# EAGLE design overview_mcu (EAGLE 9.5.0)
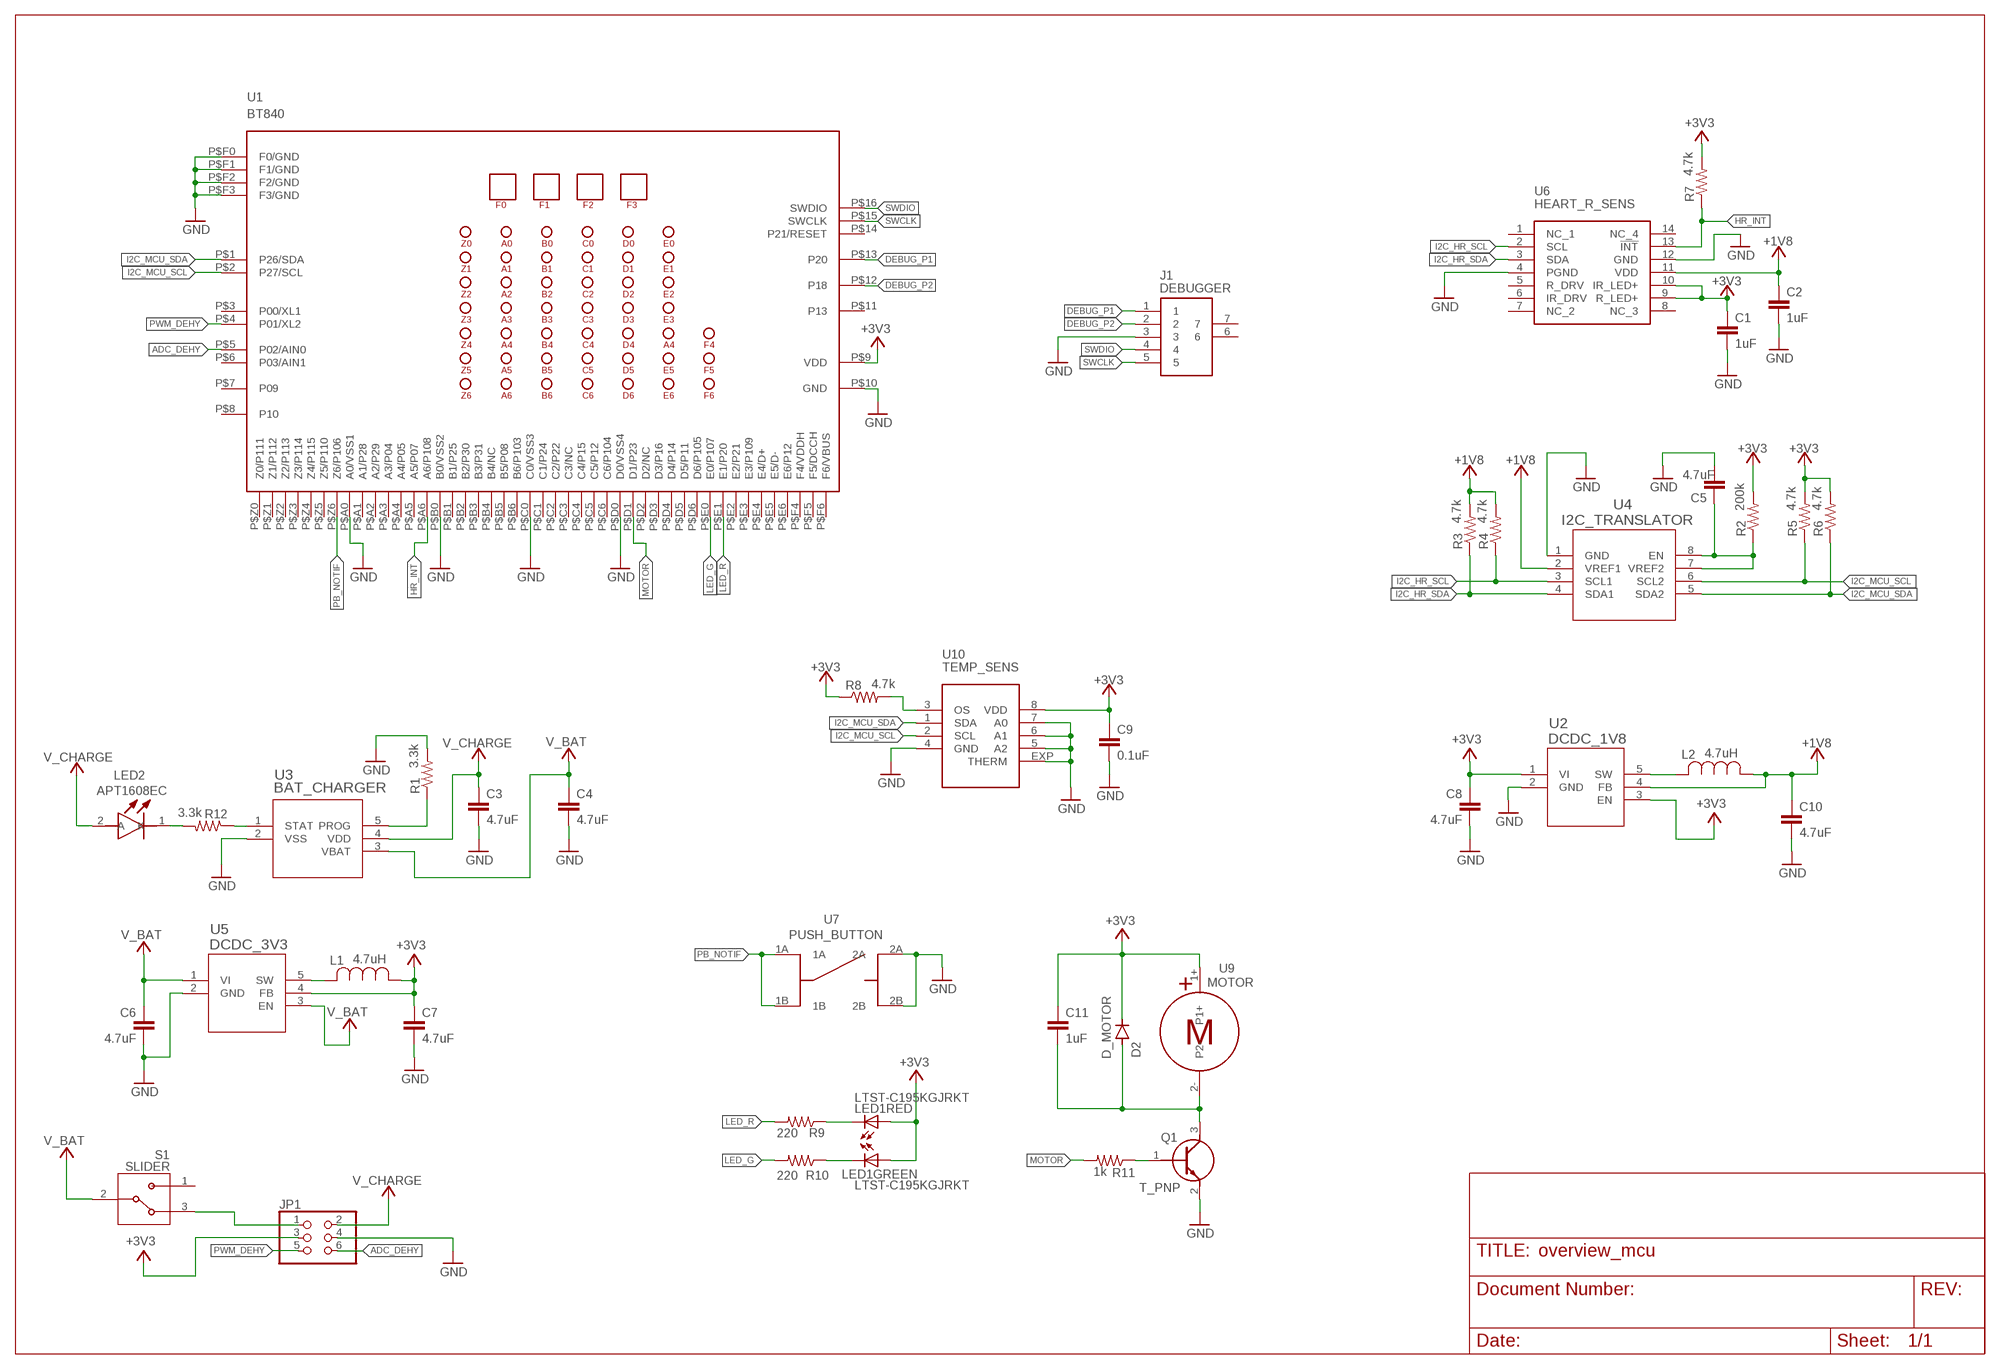
[diagram p0: schematic, sheet 1]

## Parts
C1  1uF  C-EUC0402K  [C0402K]
C2  1uF  C-EUC0402K  [C0402K]
C3  4.7uF  C-EUC0402K  [C0402K]
C4  4.7uF  C-EUC0402K  [C0402K]
C5  4.7uF  C-EUC0402K  [C0402K]
C6  4.7uF  C-EUC0402K  [C0402K]
C7  4.7uF  C-EUC0402K  [C0402K]
C8  4.7uF  C-EUC0402K  [C0402K]
C9  0.1uF  C-EUC0402K  [C0402K]
C10  4.7uF  C-EUC0402K  [C0402K]
C11  1uF  C-EUC0402K  [C0402K]
D2  D_MOTOR  CGRM4001-G  [SOD-123_MINI-SMA]
J1  DEBUGGER  [0512810594]
JP1  PINHD-2X3  [2X03]
L1  4.7uH  L_0604  [IND_1608]
L2  4.7uH  L_0604  [IND_1608]
LED1  LTST-C195KGJRKT  [LED-SMT]
LED2  APT1608EC  [LEDC1608X85N]
Q1  T_PNP  [SOT95P240X93-3N]
R1  3.3k  R-US_R0402  [R0402]
R2  200k  R-US_R0402  [R0402]
R3  4.7k  R-US_R0402  [R0402]
R4  4.7k  R-US_R0402  [R0402]
R5  4.7k  R-US_R0402  [R0402]
R6  4.7k  R-US_R0402  [R0402]
R7  4.7k  R-US_R0402  [R0402]
R8  4.7k  R-US_R0402  [R0402]
R9  220  R-US_R0402  [R0402]
R10  220  R-US_R0402  [R0402]
R11  1k  R-US_R0402  [R0402]
R12  3.3k  R-US_R0402  [R0402]
S1  SLIDER  [SW_CJS-1200TA]
U1  BT840  [BT840]
U2  DCDC_1V8  [DBV5]
U3  BAT_CHARGER  [SOT-23-5_MC]
U4  I2C_TRANSLATOR  [DQE8]
U5  DCDC_3V3  [DBV5]
U6  HEART_R_SENS  [MAX30102]
U7  PUSH_BUTTON  [PUSH_BUTTON]
U9  MOTOR  [MOTOR]
U10  TEMP_SENS  [MAX30205]

## Nets
+1V8: C2.1 C10.1 L2.1 R3.2 R4.2 U2.4(FB) U4.2(VREF1) U6.11(VDD)
+3V3: C1.1 C7.1 C8.1 C9.1 C11.1 D2.C JP1.3 L1.1 LED1.P$1(GREEN:A) LED1.P$2(RED:A) R2.2 R5.2 R6.2 R7.2 R8.1 U1.P$9(VDD) U2.1(VI) U2.3(EN) U5.4(FB) U6.9(R_LED+) U6.10(IR_LED+) U9.1+ U10.8(VDD)
ADC_DEHY: JP1.6 U1.P$5(P02/AIN0)
DEBUG_P1: J1.1 U1.P$13(P20)
DEBUG_P2: J1.2 U1.P$12(P18)
GND: C1.2 C2.2 C3.2 C4.2 C5.2 C6.2 C7.2 C8.2 C9.2 C10.2 J1.3 JP1.4 Q1.2(E) R1.2 U1.P$10(GND) U1.P$A0(A0/VSS1) U1.P$B0(B0/VSS2) U1.P$C0(C0/VSS3) U1.P$D0(D0/VSS4) U1.P$F0(F0/GND) U1.P$F1(F1/GND) U1.P$F2(F2/GND) U1.P$F3(F3/GND) U2.2(GND) U3.2(VSS) U4.1(GND) U5.2(GND) U6.4(PGND) U6.12(GND) U7.2A U7.2B U10.4(GND) U10.5(A2) U10.6(A1) U10.7(A0) U10.EXP(THERM)
HR_INT: R7.1 U1.P$A6(A6/P108) U6.13(!INT)
I2C_HR_SCL: R4.1 U4.3(SCL1) U6.2(SCL)
I2C_HR_SDA: R3.1 U4.4(SDA1) U6.3(SDA)
I2C_MCU_SCL: R5.1 U1.P$2(P27/SCL) U4.6(SCL2) U10.2(SCL)
I2C_MCU_SDA: R6.1 U1.P$1(P26/SDA) U4.5(SDA2) U10.1(SDA)
LED_G: R10.2 U1.P$E0(E0/P107)
LED_R: R9.2 U1.P$E1(E1/P20)
MOTOR: R11.2 U1.P$D1(D1/P23)
N$1: JP1.1 S1.3
N$2: R1.1 U3.5(PROG)
N$3: C5.1 R2.1 U4.7(VREF2) U4.8(EN)
N$4: L1.2 U5.5(SW)
N$5: L2.2 U2.5(SW)
N$6: LED1.P$4(RED:C) R9.1
N$7: R8.2 U10.3(OS)
N$8: LED1.P$3(GREEN:C) R10.1
N$9: R12.1 U3.1(STAT)
N$10: LED2.1(K) R12.2
N$11: C11.2 D2.A Q1.3(C) U9.2-
N$12: Q1.1(B) R11.1
PB_NOTIF: U1.P$Z6(Z6/P106) U7.1A U7.1B
PWM_DEHY: JP1.5 U1.P$4(P01/XL2)
SWCLK: J1.5 U1.P$15(SWCLK)
SWDIO: J1.4 U1.P$16(SWDIO)
V_BAT: C4.1 C6.1 S1.2 U3.3(VBAT) U5.1(VI) U5.3(EN)
V_CHARGE: C3.1 JP1.2 LED2.2(A) U3.4(VDD)
Unconnected: J1.6 J1.7 S1.1 U1.P$3(P00/XL1) U1.P$6(P03/AIN1) U1.P$7(P09) U1.P$8(P10) U1.P$11(P13) U1.P$14(P21/RESET) U1.P$A1(A1/P28) U1.P$A2(A2/P29) U1.P$A3(A3/P04) U1.P$A4(A4/P05) U1.P$A5(A5/P07) U1.P$B1(B1/P25) U1.P$B2(B2/P30) U1.P$B3(B3/P31) U1.P$B4(B4/NC) U1.P$B5(B5/P08) U1.P$B6(B6/P103) U1.P$C1(C1/P24) U1.P$C2(C2/P22) U1.P$C3(C3/NC) U1.P$C4(C4/P15) U1.P$C5(C5/P12) U1.P$C6(C6/P104) U1.P$D2(D2/NC) U1.P$D3(D3/P16) U1.P$D4(D4/P14) U1.P$D5(D5/P11) U1.P$D6(D6/P105) U1.P$E2(E2/P21) U1.P$E3(E3/P109) U1.P$E4(E4/D+) U1.P$E5(E5/D-) U1.P$E6(E6/P12) U1.P$F4(F4/VDDH) U1.P$F5(F5/DCCH) U1.P$F6(F6/VBUS) U1.P$Z0(Z0/P111) U1.P$Z1(Z1/P112) U1.P$Z2(Z2/P113) U1.P$Z3(Z3/P114) U1.P$Z4(Z4/P115) U1.P$Z5(Z5/P110) U6.1(NC_1) U6.5(R_DRV) U6.6(IR_DRV) U6.7(NC_2) U6.8(NC_3) U6.14(NC_4)

## Library data of the parts
C1-C11 = resistor:C-EU: CAPACITOR, European symbol
D2 = diode:CGRM400*-G: Molded plasitc,JEDEC SOD-123/Mini SMA Source: Comchip CGRM4001-G.pdf
J1 = FPC_0512810594:DEBUGGER: CONN FFC FPC 5POS 0.50MM R/A Source: Datasheet <http://www.molex.com/webdocs/datasheets/pdf/en-us//0512810594_FFC_FPC_CONNECTORS.pdf>; DESCRIPTION: CONN FFC FPC 5POS 0.50MM R/A; LINK: https://www.digikey.com/product-detail/en/molex-llc/0512810594/WM12846CT-ND/4176653; MANUFACTURER_NAME: Molex; MANUFACTURER_PART_NUM: 0512810594
JP1 = pinhead:PINHD-2X3: PIN HEADER
L1 L2 = L_0604:L_0604; MANUFACTURER_PART_NUMBER: GLFR1608T4R7MLR; VENDOR: TDK
LED1 = Led_LTST-C195KGJRKT:LTST-C195KGJRKT; DESCRIPTION: LED GREEN/RED CLEAR CHIP SMD; LINK: https://www.digikey.com/product-detail/en/lite-on-inc/LTST-C195KGJRKT/160-1452-1-ND/386846; MANUFACTURER: Lite-On Inc.; MANUFACTURER_PART_NUM: LTST-C195KGJRKT
LED2 = LED_APT1608EC:APT1608EC: Standard LEDs - SMD HI EFF RED WTR CLR Source: Datasheet <http://docs-emea.rs-online.com/webdocs/142e/0900766b8142ead4.pdf>; DESCRIPTION: LED RED CLEAR CHIP SMD; LINK: https://www.digikey.com/product-detail/en/kingbright/APT1608EC/754-1117-1-ND/1747834; MANUFACTURER: Kingbright; MANUFACTURER_PART_NUM: APT1608EC
Q1 = transistor:T_PNP: Transistor GP BJT NPN 40V 0.2A SOT23 Fairchild MMBT3904 NPN Bipolar Transistor, 0.2 A, 40 V, 3-Pin SOT-23 Source: Datasheet <https://www.fairchildsemi.com/datasheets/MM/MMBT3904.pdf>; DESCRIPTION: TRANS NPN 40V 0.2A SOT23; LINK: https://www.digikey.com/products/en?keywords=MMBT3904TPMSCT; MANUFACTURER: Micro Commercial Co; MANUFACTURER_PART_NUM: MMBT3904-TP
R1-R12 = resistor:R-US_: RESISTOR, American symbol
S1 = slider:SLIDER: Switch Slide N.O./N.C. SPDT Raised Slide 0.1A 24VDC J-Hook SMD Embossed T/R; DESCRIPTION: SWITCH SLIDE SPDT 100MA 6V; LINK: https://www.digikey.com/product-detail/en/nidec-copal-electronics/CJS-1200TA/563-1021-1-ND/948401; MANUFACTURER: Nidec Copal Electronics; MANUFACTURER_PART: CJS-1200TA
U1 = Nrf52_BT840:BT840; DESCRIPTION: NRF52840 BLUETOOTH 5, THREAD, ZI; LINK: https://www.fanstel.com/bt840f-nrf52840-ble-5-module-secure-iot-802154-thread-zigbee; MANUFACTURER: Fanstel; MANUFACTURER_PART_NUM: BT840
U2 = DCDC_1V8_TPS62202DBVR:DCDC_1V8; DESCRIPTION: IC REG BUCK 1.8V 0.3A SYNC SOT23; LINK: https://www.digikey.com/product-detail/en/texas-instruments/TPS62202DBVR/296-16730-1-ND/616311; MANUFACTURER: Texas Instruments; MANUFACTURER_PART_NUM: TPS62202DBVR
U3 = BatManager_MCP73831:BAT_CHARGER; DESCRIPTION: IC CONTROLLR LI-ION 4.2V SOT23-5; LINK: https://www.digikey.com/product-detail/en/microchip-technology/MCP73831T-2ACI-OT/MCP73831T-2ACI-OTCT-ND/1979802; MANUFACTURER: Microchip; MANUFACTURER_PART_NUM: MCP73831T2ACIOT
U4 = I2Ctranslator_PCA9306DQER:I2C_TRANSLATOR; DESCRIPTION: IC TRNSLTR BIDIRECTIONAL 8X2SON; LINK: https://www.digikey.com/product-detail/en/texas-instruments/PCA9306DQER/296-27957-1-ND/2446266; MANUFACTURER: Texas Instruments; MANUFACTURER_PART_NUM: PCA9306DQER
U5 = DCDC_3V3_TPS62203DBVR:DCDC_3V3; DESCRIPTION: IC REG BUCK 3.3V 0.3A SYNC SOT23; LINK: https://www.digikey.com/product-detail/en/texas-instruments/TPS62203DBVR/296-39452-1-ND/5143400; MANUFACTURER: Texas Instruments; MANUFACTURER_PART_NUM: TPS62203DBVR
U6 = heartRate_max30102:HEART_R_SENS; DESCRIPTION: IC SENSOR OXIMETER/HEARTRATE; LINK: https://www.digikey.com/product-detail/en/maxim-integrated/MAX30102EFD/MAX30102EFD-ND/6166869; MANUFACTURER: Maxim Integrated; MANUFACTURER_PART_NUM: MAX30102EFD+
U7 = push_button:PUSH_BUTTON; DESCRIPTION: SWITCH TACTILE SPST-NO 0.05A 12V; LINK: https://www.digikey.com/product-detail/en/panasonic-electronic-components/EVQ-P7A01P/P16763CT-ND/4429456; MANUFACTURER: Panasonic Electronic Components; MANUFACTURER_PART_NUM: EVQ-P7A01P
U9 = motor:MOTOR; DESCRIPTION: VIBRATION MOTOR CYL 2.7V SMD; LINK: https://www.digikey.com/product-detail/en/jinlong-machinery-electronics-inc/Z4FC1B1301781/1670-1011-1-ND/6009936; MANUFACTURER: Jinlong Machinery & Electronics, Inc.; MANUFACTURER_PART_NUM: Z4FC1B1301781
U10 = temp_max30205:TEMP_SENS; DESCRIPTION: SWITCH TACTILE SPST-NO 0.05A 12V; LINK: https://www.digikey.com/product-detail/en/panasonic-electronic-components/EVQ-P7A01P/P16763TR-ND/4429447; MANUFACTURER: Maxim Integrated; MANUFACTURER_PART_NUM: MAX30205MTA+

## Board
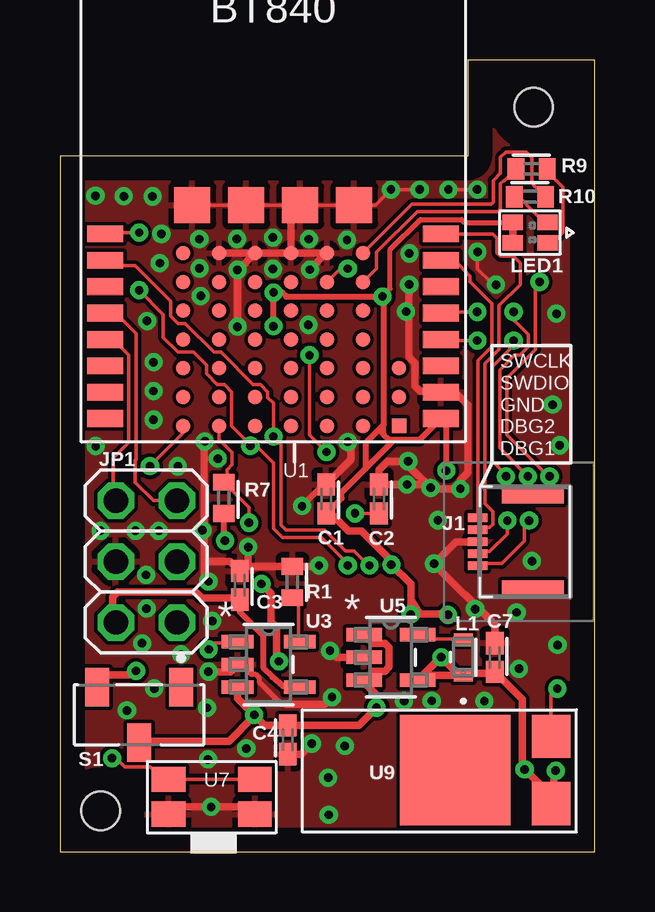
[diagram p1: board, top side]
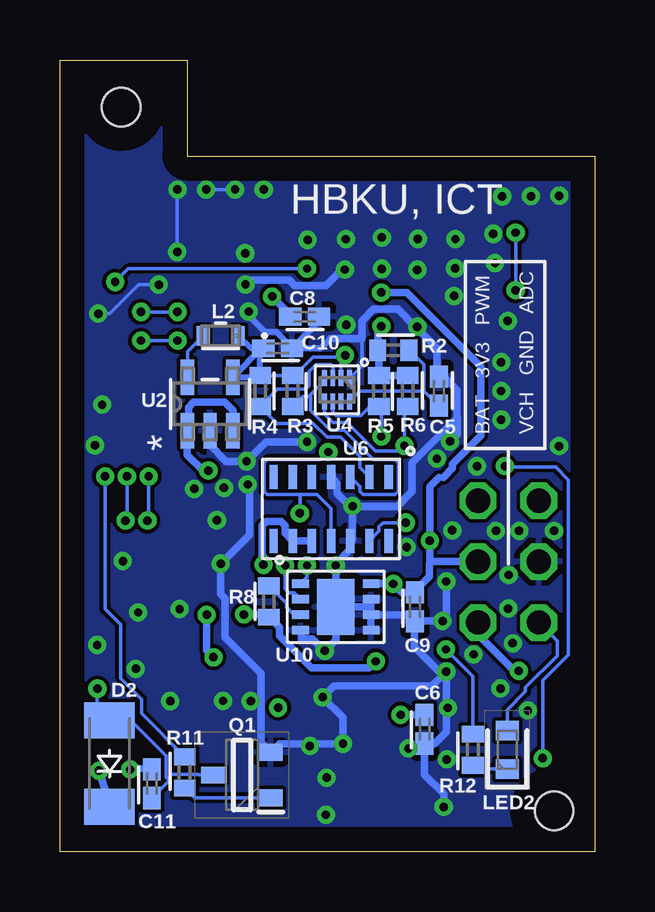
[diagram p2: board, bottom side, seen from below]

Size 22.3 x 33 mm. Coordinates in mm from the lower left corner, seen from the top.
Outline: 0,0 22.3,0 22.3,33 17,33 17,29 0,29 0,0
Copper layers (1*16): Top 0.035mm / dielectric 1.5mm / Bottom 0.035mm
Design rules "default *": minimum track width 6mil, minimum drill 0.35mm, track to track 6mil, track to pad 6mil, pad to pad 6mil, via to via 6mil, smd to smd 6mil, copper to edge 40mil, drill to drill 6mil, minimum pad ring 10mil, minimum via ring 8mil, stop-mask expansion 4mil, vias tented up to drill 0.36mm, thermal gap 10mil
Holes 1.6 mm at 19.75,31.03 1.7,1.7

### Footprints (pad centres in the part's own frame; a part is rotated, then mirrored left to right if it is on the bottom)
C0402K = smd 0.925 x 0.74: 1 -0.6,0; 2 0.6,0
SOD-123_MINI-SMA = smd 1.5 x 2.1: A 1.8,0; C -1.8,0
0512810594 = smd 0.35 x 0.8: 1 -1,1.725; 2 -0.5,1.725; 3 0,1.725; 4 0.5,1.725; 5 1,1.725 | smd 0.6 x 2.6: 6 -1.9,-0.575; 7 1.9,-0.575
2X03 = drill 1.016 octagon: 1 -2.54,-1.27; 2 -2.54,1.27; 3 0,-1.27; 4 0,1.27; 5 2.54,-1.27; 6 2.54,1.27
IND_1608 = smd 0.503 x 0.8: 1 -0.752,0; 2 0.752,0
LED-SMT = smd 0.65 x 0.85: P$1 0.425,0.725; P$2 -0.425,0.725; P$3 0.425,-0.725; P$4 -0.425,-0.725
LEDC1608X85N = smd 0.8 x 0.95: 1 -0.8,0; 2 0.8,0
SOT95P240X93-3N = smd 1 x 0.7: 1 -1.2,0.95; 2 -1.2,-0.95; 3 1.2,0
R0402 = smd 0.7 x 0.9: 1 -0.65,0; 2 0.65,0
SW_CJS-1200TA = smd 1 x 1.6: 1 -1.75,-1.15; 2 0,1.15; 3 1.75,-1.15
BT840 = smd 1.5 x 0.7: P$1 -7.112,3.847; P$2 -7.112,2.747; P$3 -7.112,1.647; P$4 -7.112,0.547; P$5 -7.112,-0.553; P$6 -7.112,-1.653; P$7 -7.112,-2.753; P$8 -7.112,-3.853; P$9 6.888,-3.853; P$10 6.888,-2.753; P$11 6.888,-1.653; P$12 6.888,-0.553; P$13 6.888,0.547; P$14 6.888,1.647; P$15 6.888,2.747; P$16 6.888,3.847 | smd 0.6 x 0.6: P$A0 -2.362,3.047; P$A1 -2.362,1.847; P$A2 -2.362,0.647; P$A3 -2.362,-0.553; P$A4 -2.362,-1.753; P$A5 -2.362,-2.953; P$A6 -2.362,-4.153; P$B0 -0.862,3.047; P$B1 -0.862,1.847; P$B2 -0.862,0.647; P$B3 -0.862,-0.553; P$B4 -0.862,-1.753; P$B5 -0.862,-2.953; P$B6 -0.862,-4.153; P$C0 0.638,3.047; P$C1 0.638,1.847; P$C2 0.638,0.647; P$C3 0.638,-0.553; P$C4 0.638,-1.753; P$C5 0.638,-2.953; P$C6 0.638,-4.153; P$D0 2.138,3.047; P$D1 2.138,1.847; P$D2 2.138,0.647; P$D3 2.138,-0.553; P$D4 2.138,-1.753; P$D5 2.138,-2.953; P$D6 2.138,-4.153; P$E0 3.638,3.047; P$E1 3.638,1.847; P$E2 3.638,0.647; P$E3 3.638,-0.553; P$E4 3.638,-1.753; P$E5 3.638,-2.953; P$E6 3.638,-4.153; P$F4 5.138,-1.753; P$F5 5.138,-2.953; P$F6 5.138,-4.153; P$Z0 -3.862,3.047; P$Z1 -3.862,1.847; P$Z2 -3.862,0.647; P$Z3 -3.862,-0.553; P$Z4 -3.862,-1.753; P$Z5 -3.862,-2.953; P$Z6 -3.862,-4.153 | smd 1.5 x 1.5: P$F0 -3.482,5.047; P$F1 -1.232,5.047; P$F2 1.018,5.047; P$F3 3.268,5.047
DBV5 = smd 1.473 x 0.559: 1 -1.118,0.95; 2 -1.118,0; 3 -1.118,-0.95; 4 1.118,-0.95; 5 1.118,0.95
SOT-23-5_MC = smd 1.321 x 0.559: 1 -1.295,0.95; 2 -1.295,0; 3 -1.295,-0.95; 4 1.295,-0.95; 5 1.295,0.95
DQE8 = smd 0.66 x 0.203: 1 -0.495,0.525; 2 -0.495,0.175; 3 -0.495,-0.175; 4 -0.495,-0.525; 5 0.495,-0.525; 6 0.495,-0.175; 7 0.495,0.175; 8 0.495,0.525
MAX30102 = smd 1 x 0.35: 1 -1.325,2.4; 2 -1.325,1.6; 3 -1.325,0.8; 4 -1.325,0; 5 -1.325,-0.8; 6 -1.325,-1.6; 7 -1.325,-2.4; 8 1.325,-2.4; 9 1.325,-1.6; 10 1.325,-0.8; 11 1.325,0; 12 1.325,0.8; 13 1.325,1.6; 14 1.325,2.4
PUSH_BUTTON = smd 1.4 x 1.05: 1A -1.859,0.721; 1B 1.741,0.721; 2A -1.859,-0.729; 2B 1.741,-0.729
MOTOR = smd 1.8 x 1.6: 1+ -1.402,-3.996; 2- 1.4,-3.996 | smd 4.6 x 4.6: 3 0,0
MAX30205 = smd 0.7 x 0.35: 1 -1.475,0.975; 2 -1.475,0.325; 3 -1.475,-0.325; 4 -1.475,-0.975; 5 1.475,-0.975; 6 1.475,-0.325; 7 1.475,0.325; 8 1.475,0.975 | smd 1.58 x 2.35: EXP 0,0

### Placement (x,y rotation side)
C1  11.1,14.7 90 top
C2  13.3,14.7 90 top
C3  7.5,11.1 90 top
C4  9.5,4.66 270 top
C5  6.5,19.2 90 bottom
C6  7.1,5.1 270 bottom
C7  18.13,8.09 90 top
C8  12.1,22.3 0 bottom
C9  7.5,10.2 270 bottom
C10  13.22,20.98 0 bottom
C11  18.47,2.83 270 bottom
D2  20.23,3.66 90 bottom
J1  19.14,12.91 90 top
JP1  3.6,12.09 90 top
L1  16.82,8.1 90 top
L2  15.6,21.5 180 bottom
LED1  19.6,25.8 90 top
LED2  3.65,4.24 90 bottom
Q1  14.71,3.19 180 bottom
R1  9.69,11.23 90 top
R2  8.4,20.9 180 bottom
R3  12.6,19.2 90 bottom
R4  13.95,19.2 90 bottom
R5  9,19.2 90 bottom
R6  7.8,19.2 90 bottom
R7  6.83,14.75 270 top
R8  13.59,10.42 90 bottom
R9  19.66,28.46 180 top
R10  19.6,27.3 0 top
R11  17.1,3.3 90 bottom
R12  5.08,4.25 270 bottom
S1  3.3,5.7 180 top
U1  9,21.9 0 top
U2  16.04,18.66 90 bottom
U3  8.7,7.8 0 top
U4  10.75,19.25 270 bottom
U5  13.8,8.1 0 top
U6  10.99,14.28 270 bottom
U7  6.39,2.29 0 top
U9  16.48,3.4 90 top
U10  10.8,10.2 0 bottom

### Tracks (layer width: path | path; a pad name or v marks a point on that pad's centre or on a via)
+1V8  (via drill 0.35)
  Top 0.152: v10.41,20.69 10.41,17.36 v11.11,16.66 | C2.1 v12.3,14.1
  Bottom 0.152: 14.02,19.78 R4.2 R3.2 12.52,19.85 11.74,20.62 10.48,20.62 | v11.11,16.66 11.43,16.34 13.66,16.34 13.8,16.2 13.8,15.01 13.66,14.88 12.3,14.88 | 12.3,14.88 11.58,14.88 10.99,14.29 U6.11 | v12.3,14.1 12.3,14.88 | 10.48,20.62 v10.41,20.69 | 13.95,20.85 C10.1 13.89,20.98 | 10.48,20.62 10.57,20.52 U4.2
  Bottom 0.254: 14.02,19.78 U2.4 13.89,20.98 | C10.1 14.33,20.98 L2.1 | R4.2 13.95,20.85
+3V3  (via drill 0.35)
  Top 0.152: 20.46,2.34 20.46,2.01 U9.1+ | 16.84,7.42 L1.1 | C7.1 17.86,7.49 17.93,7.42 | 16.72,7.35 L1.1 | 14.97,7.19 U5.4 15.12,7.35 | 16.65,7.35 L1.1 | v8.4,11.16
  Top 0.2: v13.45,23.14 13.77,23.46 13.77,25.09 15.03,26.35 16.74,26.35 16.87,26.23 LED1.P$1
  Top 0.254: R7.2 6.83,13.01 v6.88,12.96 | 13.5,23.1 v13.46,23.14 v13.45,23.14 | v8.9,21.9 v8.9,23.3 9.26,23.3 9.44,23.13 13.5,23.13 13.5,23.1 | v16.11,15.88 16.11,17.82 U1.P$9 15,17.16 13.93,17.16 | 11.13,14.1 C1.1 | 11.13,14.1 11.75,14.72 11.75,14.98 12.74,15.97 | 11.3,14.1 11.13,14.1 | 13.49,17.79 13.32,17.61 | 13.32,17.61 12.74,17.03 12.74,15.97 | 13.5,23.1 13.5,17.79 13.49,17.79 | 13.93,17.16 13.84,17.06 | 13.84,17.06 12.74,15.97 | 13.84,17.06 13.73,17.17 13.72,17.17 | 13.72,17.17 13.49,17.39 | 13.49,17.39 13.32,17.57 13.32,17.61 | 13.49,17.39 13.49,17.79 | 13.93,17.16 13.73,17.16 13.72,17.17
  Top 0.305: 17.93,7.42 16.84,7.42 | 16.72,7.35 15.12,7.35 14.97,7.19 | 16.65,7.35 v15.9,8.1 15.87,8.1 U5.4 | v20.67,3.37 20.48,2.32 U9.1+ | 20.46,2.34 v19.38,3.42 19.29,3.52 19.29,6.33 C7.1 | v16.18,9.87 16.02,9.91 15.01,9.91 | 15.01,9.91 14.66,9.91 v14.63,9.88 14.63,10.5 | 14.63,10.5 14.63,11.15 v13.82,11.96 13.82,12.12 12.57,13.36 12.04,13.36 11.3,14.1 | v9.13,7.93 9.03,8.03 9.03,9.34 8.79,9.57 8.79,10.76 v8.4,11.16 | 14.63,10.5 15.01,9.91 | LED1.P$1 LED1.P$2
  Bottom 0.152: R2.2 9,20.85 | 7.55,10.81 C9.1 | C11.1 18.53,3.49 | 6.81,12.09 6.88,12.02 6.9,12
  Bottom 0.254: 8.89,23.29 v8.9,23.3 | 9.05,21.85 9,21.9 v8.9,21.9 | 6.32,15.6 6.49,15.6
  Bottom 0.305: R6.2 R5.2 9,20.85 | 16.02,8.22 v15.9,8.1 16.18,8.38 v16.18,9.87 | v20.67,3.37 20.23,1.97 D2.C | 18.53,3.49 v19.38,3.42 | v9.13,7.93 9.41,7.65 11.82,7.65 13.15,8.98 13.15,9.33 R8.1 13.7,9.88 v14.63,9.88 | 6.88,12.02 v6.88,12.96 6.88,15.21 6.49,15.6 | 6.9,12 6.9,11.46 7.55,10.81 | 8.89,23.29 7.82,23.29 4.76,20.23 4.76,17.33 5.93,16.16 5.93,15.99 6.32,15.6 | R2.2 9.05,21.85 | C9.1 8.04,10.8 v8.4,11.16 8.42,11.18 U10.8 | JP1.3 6.81,12.09 | U2.3 15.09,18.39 15.43,18.73 16.73,18.73 16.94,18.52 16.94,17.59 U2.1 16.99,16.54 16.33,15.88 v16.11,15.88 | v13.45,23.14 12.7,22.39 C8.1 | U6.10 U6.9 12.91,13.28 12.91,13.58 13.09,13.76 13.69,13.76 13.87,13.58 13.87,12.33 13.82,12.28 v13.82,11.96
ADC_DEHY
  Top 0.152: JP1.6 2.22,14.74 2.22,16.41 2.87,17.06 2.87,20.69 2.21,21.35 U1.P$5
DEBUG_P1  (via drill 0.35)
  Top 0.152: v18.92,22.5 18.92,22.16 19.52,21.55 19.52,21.05 19.17,20.69 18.95,20.69 18.33,20.08 18.33,16.82 v19.51,15.64 | v19.56,13.8 19.36,13.8 19.36,12.94 18.43,12.01 17.42,12.01 J1.1 | v17.4,22.5 15.94,22.5 U1.P$13
  Bottom 0.152: v19.51,15.64 v19.5,15.63 19.5,13.8 v19.56,13.8 | v17.4,22.5 v18.92,22.5
DEBUG_P2  (via drill 0.35)
  Top 0.152: v18.92,21.3 18.91,21.29 18.91,21.09 18.03,20.21 18.03,16.27 18.6,15.7 v18.6,15.64 | J1.2 17.52,12.51 17.91,12.51 18.65,13.25 v18.65,13.8 | v17.4,21.3 15.94,21.3 U1.P$12
  Bottom 0.152: v18.6,15.64 18.6,13.8 v18.65,13.8 | v17.4,21.3 v18.92,21.3
GND  (via drill 0.35)
  Top 0.152: C3.2 7.68,11.88 7.85,12.05 | U1.P$F0 U1.P$F1 U1.P$F2 | U1.P$F2 U1.P$F3 13.15,26.95 v13.8,27.6 v15,27.6 | U1.P$F2 9.64,26.57 | J1.3 17.41,12.9 | U1.P$B0 8.14,24.94 | v14.55,23.63 v14.56,23.64 | 6.03,16.83 6,16.79 | 11.05,6.13 v11.35,6.43 | v10.42,24.26 v10.42,24.27 | v18.18,23.63 18,23.7 17.41,24.29 v17.41,25 | v16.2,27.6 v17.4,27.6 | 7.78,7.8 7.62,7.8 U3.2 | 10.75,11.88 v10.8,11.93 | 15.5,15.12 v15.46,15.16 15.32,15.3 | 14.52,16.1 v14.52,16.27 | U7.2A 4.78,1.81 4.78,1.86
  Top 0.203: 9.45,6.13 9.25,6.13 8.32,7.06 8.32,7.24 8.17,7.38 8,7.38 7.62,7.76 7.62,7.8
  Top 0.254: C1.2 11,15.3 v10.1,14.4 | 15.84,19.2 U1.P$10 16.47,19.15
  Top 0.305: U3.2 7.11,7.5 v6.19,7.5 | v7.85,12.69 7.85,12.05 | 9.64,26.57 U1.P$C0 | U1.P$C0 11.1,24.95 v10.42,24.27 | U1.P$C0 U1.P$B0 U1.P$A0 | 6,12.1 7.1,12.1 C3.2 | 8.06,1.86 v6.3,1.86 4.78,1.86 | v14.52,16.27 13.66,16.27 13.3,15.91 C2.2 v14.47,15.3 15.32,15.3 | 17.41,12.9 16.5,12.9 v15.6,12 18.13,9.47 C7.2 | v7.4,21.88 7.4,24.2 8.14,24.94 | v14.55,23.63 14.55,20.61 14.8,20.37 14.8,19.4 15,19.2 15.84,19.2 | 6,12.1 6,16.79 | 6.03,16.83 v6.03,17.1 | C4.2 10.06,4.06 v10.5,4.5 | C1.2 12.14,16.34 12.14,16.94 v12,17.08 | U5.2 11.53,8.1 v11.26,8.37 | 10.75,11.88 R1.2 7.68,11.88 | 6,12.1 6,11.45 v6.19,11.26 | 11.05,6.13 9.45,6.13 | 16.47,19.15 17.01,18.61 17.01,15.8 16.7,15.49 v16.7,15.12 15.5,15.12 | v15.46,15.16 14.52,16.1
  Bottom 0.152: 6.58,19.88 C5.2 | 10.19,12.61 U6.12 10.1,12.98 | 10.8,12 v10.8,11.93 10.84,11.92 | 9.33,9.79 U10.6 | 10.1,14.57 v10.1,14.4 | 14.4,15.3 v14.47,15.3 | 7.75,9.88 7.51,9.63 C9.2 | v10.41,24.25 v10.42,24.26 10.54,24.26 | v17.4,27.6 v17.41,27.59 v17.41,25 | v15,27.6 v16.2,27.6 | v7.4,21.88 7.48,21.88 | 5.74,18.09 | v18.18,23.63 19.02,23.63 20.23,22.42 v20.7,22.42 | U2.2 16.04,16.94 | 14.43,22.33 v14.43,22.51 | 10.22,19.71 9.71,20.23 9.71,21.39
  Bottom 0.254: C10.2 11.42,20.98 11.02,21.39 | C8.2 11.5,22.1 C10.2 | 10.8,11.89 10.84,11.92 | C10.2 12.62,21.02 13.26,21.66 13.76,21.66 14.43,22.33
  Bottom 0.305: 6.58,19.88 6.58,20.98 7.48,21.88 | U6.4 10.75,15.36 10.75,14.92 10.4,14.57 10.1,14.57 | C5.2 6.29,19.8 5.74,19.25 5.74,18.09 | 11.02,21.39 9.71,21.39 9.71,22.12 9.22,22.61 8.21,22.61 7.49,21.89 | 10.19,12.61 10.8,12 | 9.33,9.79 9.33,9.33 | 10.1,12.98 v10.1,14.4 10.08,14.38 8.24,14.38 7.62,15 7.62,16.2 5.74,18.09 5.74,17.39 v6.03,17.1 | 12.23,9.18 12.23,8.87 11.76,8.87 v11.26,8.37 10.8,8.83 U10.EXP | 14.4,15.3 14.4,13.2 v15.6,12 15.6,10.74 15.4,10.54 15.4,8.93 13.91,7.44 13.91,4.54 Q1.2 13.15,4.5 v10.5,4.5 10.5,5.58 v11.35,6.43 10.88,6.9 6.79,6.9 v6.19,7.5 | 7.75,9.88 U10.6 9.33,10.2 | v6.3,1.86 6.3,2.4 7.1,3.2 C6.2 6.69,4.5 6.19,5 v6.19,7.5 | v14.56,23.64 14.37,23.83 12.73,23.83 12.51,23.6 11.2,23.6 10.54,24.26 | U10.EXP 10.8,11.89 | 9.33,10.2 U10.EXP | v6.19,11.26 6.19,9.77 v6.35,9.61 C9.2 | v6.19,7.5 6.48,7.5 7.51,8.53 7.51,9.63 | v12,17.08 13.71,17.08 v14.52,16.27 15.37,16.27 16.04,16.94 | U10.7 9.32,10.21 9.33,10.2
  other vias: 15.76,13.81 3.9,18 3.9,19.2 3.9,20.4 3.63,22.12 4.16,24.53 5.87,23.16 10.36,21.96 17.31,10.11 19.04,9.97 15.5,6.28 11.88,4.4 11.18,3.08 11.21,1.53 5.94,13.39 4.91,16.06 7.77,4.3 14.35,6.27 20.75,8.61 19.68,12.11 6.58,16.38 5.82,24.31 7.4,24.25 8.88,24.29 1.48,27.34 2.66,27.32 3.86,27.31 5.81,25.53 7.38,25.54 8.88,25.6 10.38,25.53 11.97,25.5 4.23,25.75 6.17,3.84 17.7,6.27 19.14,7.62 20.54,18.63 20.84,16.94 1.49,16.9 4.12,13.37 3.15,13.37 1.7,13.37 3.59,11.53 3.42,8.68 3.61,10.13 3.93,6.8 6.13,5.99 5.05,8.22 2.79,5.88 14.57,24.94
  pour Bottom: 0.23,0.18 0.23,28.78 17.3,28.78 17.3,32.74 22.12,32.74 22.12,0.18
  pour Top: 0.55,0.52 0.55,28.5 17.6,28.5 17.6,32.4 21.83,32.4 21.83,0.52
HR_INT  (via drill 0.35)
  Top 0.152: v7.88,13.71 7.88,14.35 R7.1 6.96,15.54 6.96,15.91 7.19,16.13 7.19,16.63 6.64,17.18 6.64,17.35 U1.P$A6
  Bottom 0.152: U6.13 9,13.35 9,13.55 8.84,13.71 v7.88,13.71
I2C_HR_SCL
  Bottom 0.152: 12.05,19.27 13.23,19.27 R4.1 13.25,17.85 11.75,17.85 11.17,17.27 10.59,17.27 9.79,16.47 9.79,16 U6.2 | 12.05,19.27 | 12.05,19.27 11.92,19.41 11.92,20.01 11.63,20.31 11.01,20.31 10.93,20.23 U4.3
I2C_HR_SDA
  Bottom 0.152: R3.1 12.18,18.97 11.93,18.97 11.85,19.05 | U6.3 9.8,15.21 9.8,15.01 9.66,14.88 8.32,14.88 8.19,15.01 8.19,16.2 8.32,16.34 9.23,16.34 10.47,17.58 11.04,17.58 11.85,18.38 11.85,19.05 | 11.85,19.05 11.28,19.62 U4.4
I2C_MCU_SCL  (via drill 0.35)
  Top 0.152: v12.91,11.93 12.91,11.99 12.79,11.99 12.25,12.53 11.9,12.53 11.02,13.41 9.42,13.41 9.22,13.61 9.22,16.98 v8.9,17.3 8.9,18.7 8.67,18.93 8.67,19.17 8.36,19.48 8.06,19.48 6.72,20.82 6.42,20.82 5.22,22.02 4.92,22.02 4.61,22.33 4.61,22.95 3.13,24.43 2.11,24.43 U1.P$2
  Bottom 0.152: v8.9,17.3 8.9,18.45 R5.1 9.38,18.55 9.74,18.19 10.79,18.19 10.85,18.25 10.93,18.32 U4.6 | U10.2 12.52,10.77 12.72,10.77 12.91,10.96 v12.91,11.93
I2C_MCU_SDA  (via drill 0.35)
  Top 0.152: v3.3,23.4 4.3,22.39 4.3,21.43 4.92,20.82 5.58,20.82 6.11,20.29 6.11,19.93 6.56,19.48 6.86,19.48 7.17,19.17 7.17,17.73 7.8,17.1 | 7.8,17.1 7.96,16.94 v7.93,16.91 | v12,11.93 12,12 10.9,13.1 9.29,13.1 8.92,13.48 8.92,16.2 8.02,17.1 7.8,17.1 | U1.P$1 1.94,25.8 v3.3,25.8
  Bottom 0.152: U10.1 12,11.45 v12,11.93 | v3.3,25.8 v3.3,23.4 | R6.1 7.93,18.41 v7.93,16.91 8.16,16.69 9.15,16.69 10.34,17.88 10.92,17.88 11.28,18.24 U4.5
LED_G
  Top 0.152: R10.2 19.83,27.72 19.8,27.72 19.67,27.86 19.67,28.94 19.45,29.16 18.59,29.16 18.37,28.95 18.37,28.28 18.07,27.97 18.07,27.07 17.98,26.98 14.67,26.98 U1.P$E0
LED_R
  Top 0.152: R9.2 18.53,27.98 18.5,27.98 18.37,27.84 18.37,26.8 18.25,26.68 14.9,26.68 13.2,24.98 13.2,24.31 U1.P$E1
MOTOR  (via drill 0.35)
  Top 0.152: v20.42,15.64 20.4,15.62 20.4,15.6 20.12,15.88 20.12,15.89 18.64,17.37 18.64,19.73 19.83,20.92 19.83,23.58 v20,23.75 | v12,24.3 11.69,24.3 U1.P$D1
  Bottom 0.152: R11.2 18.9,5.75 18.9,6.35 19.77,7.22 19.77,9.46 20.42,10.11 v20.42,15.64 | v20,23.75 19.45,24.3 v12,24.3
N$1  (via drill 0.35)
  Top 0.152: S1.3 1.55,7.36
  Top 0.305: 1.55,7.36 3,7.36 v3.17,7.53
  Bottom 0.305: JP1.1 4.87,9.06 3.34,7.53 v3.17,7.53
N$2
  Top 0.152: U3.5 9.94,8.87 9.94,10.33 R1.1
N$3
  Bottom 0.152: 7.12,19.2 7.12,20.3 7.73,20.9 R2.1 | C5.1 6.52,18.6 7.12,19.2 | 7.12,19.2 9.78,19.2 U4.8 U4.7
N$4
  Top 0.152: L1.2 16.72,8.87 15.12,8.87 14.97,9.02 U5.5
N$5
  Bottom 0.152: U2.5 16.97,19.8 16.97,20.84 16.35,21.46 L2.2
N$6
  Top 0.152: R9.1 20.31,28.36 20.98,27.7 20.98,25.8 20.55,25.38 LED1.P$4
N$7
  Bottom 0.152: R8.2 12.85,10.33 12.85,10.2 12.53,9.88 U10.3
N$8
  Top 0.152: R10.1 19.13,27.3 19.76,26.66 19.8,26.62 20.2,26.23 LED1.P$3
N$9  (via drill 0.35)
  Top 0.152: U3.1 7.36,8.7 6.48,8.7 v6.2,8.43
  Bottom 0.152: R12.1 5.08,7.3 v6.2,8.43
N$10
  Bottom 0.152: LED2.1 4.92,3.44 R12.2
N$11  (via drill 0.35)
  Top 0.152: U9.2- 20.48,6.53 v20.74,6.79
  Bottom 0.152: Q1.3 16.52,3.19 16.55,3.23 17.64,3.23 17.78,3.1 17.78,3 | 17.78,3 17.78,2.92 C11.2 | 17.78,3 17.87,3.09 17.87,3.99 19.28,5.4 20.17,5.4 D2.A 20.23,5.53 20.74,6.04 v20.74,6.79
N$12
  Bottom 0.152: Q1.1 16.69,2.24 R11.1
PB_NOTIF  (via drill 0.35)
  Top 0.152: v2.17,3.89 2.34,3.89 2.71,3.52 3.76,3.52 4.4,2.88 U7.1A U7.1B | U1.P$Z6 5.14,17.46 v3.75,16.07
  Bottom 0.152: v2.17,3.89 2.17,7.13 1.09,8.21 1.09,15.49 1.63,16.03 3.71,16.03 v3.75,16.07
PWM_DEHY
  Top 0.152: JP1.5 3.9,14.63 3.14,15.39 3.14,16.32 3.17,16.35 3.17,21.6 2.32,22.45 U1.P$4
SWCLK
  Top 0.152: J1.5 17.42,20.46 18.01,21.05 18.01,22.85 17.1,23.76 17.1,24 16.45,24.65 U1.P$15
SWDIO
  Top 0.152: J1.4 17.52,13.51 17.91,13.51 18.05,13.64 18.05,14.18 17.72,14.5 17.72,20.34 18.31,20.92 18.31,22.75 19.2,23.64 19.2,24.52 18.9,24.82 18.36,24.82 18.22,24.95 18.22,25.58 18.05,25.75 U1.P$16
V_BAT  (via drill 0.35)
  Top 0.152: 12.84,6.89 12.69,7.04 U5.3 12.72,7.09 | S1.2 3.35,4.6 3.39,4.6
  Top 0.305: v8.1,5.7 7.41,6.39 U3.3 | 3.39,4.6 7.04,4.6 8.1,5.66 v8.1,5.7 | v8.1,5.7 8.54,5.26 C4.1 12.46,5.26 v13.2,6 13.2,6.53 12.84,6.89 12.72,7.09 12.68,7.13 13.07,7.52 13.54,7.52 13.72,7.69 13.72,8.51 13.54,8.68 13.05,8.68 U5.1
  Bottom 0.305: C6.1 v8.1,5.7
V_CHARGE
  Top 0.152: 9.94,6.89 U3.4 | 7.5,10.39 C3.1
  Top 0.254: 7.5,10.39 7.5,9.98 8.47,9.02 8.47,7.66 8.86,7.27 9.3,6.9 9.94,6.89
  Top 0.305: JP1.2 2.2,9.68 2.2,10.62 2.41,10.83 5.66,10.83 5.91,10.58 7.42,10.58 C3.1
  Bottom 0.152: LED2.2 3.65,5.91 2.88,6.68 2.88,6.85 1.57,8.17 1.57,8.79 JP1.2

### Text on the board
tPlace: SWCLK / SWDIO / GND / DBG2 / DBG1
bPlace: HBKU, ICT | BAT 3V3 PWM / / VCH GND ADC
tNames: LED1 | U1 | U7 | U9